# Altium schematic sheet 03 BEEP.SchDoc
size A4
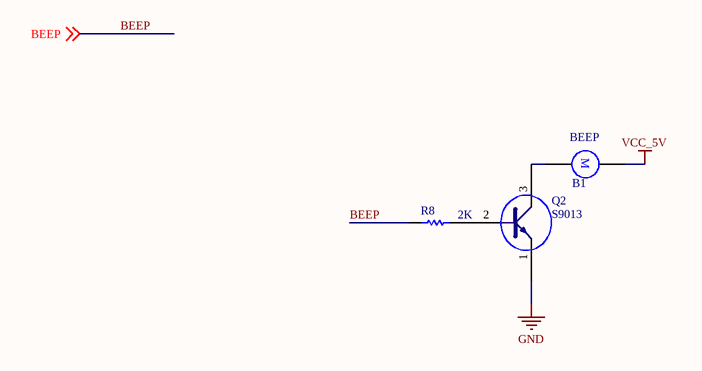
[diagram p0: 03 BEEP.SchDoc]

## Parts
B1  BEEP  [Beep]
Q2  S9013  [PNP-SOT-23]
R8  2K  [R0603]

## Nets
GND: Q2.1
VCC_5V: B1.1
BEEP: R8.1 ; off-sheet BEEP
NetB1_2: B1.2 Q2.3
NetQ2_2: Q2.2 R8.2

## Notes on the sheet
- (in symbol Motor) M

## Library data of the parts
B1 = Motor: Motor, General Kind; Manufacturer: Generic Components; Published: 1999
R8 = Res1: Resistor; Manufacturer: Generic Components; Class: Passive; Value: 100; Published: 08/06/2000; Publisher: Altium Hobart Technology Centre; SubClass: Resistor